# EAGLE design 5v ac to dc (EAGLE 9.6.2)
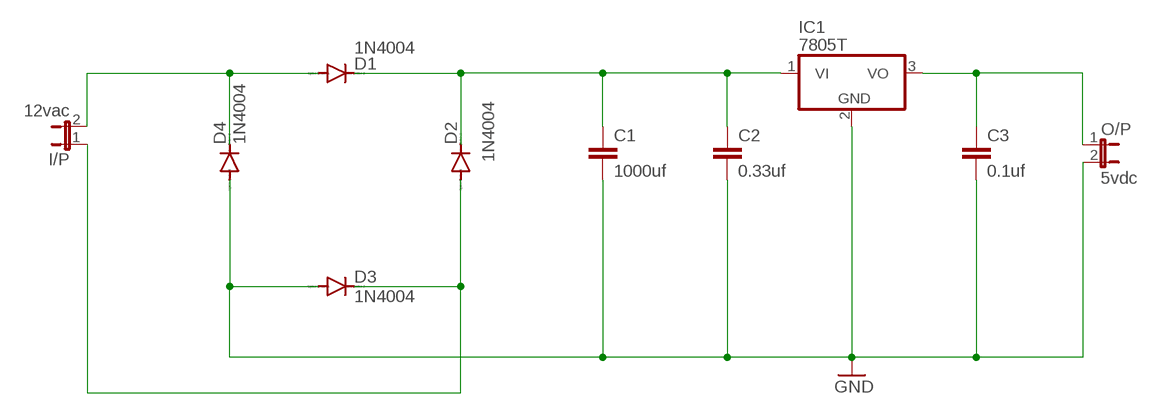
[diagram p0: schematic, sheet 1]

## Parts
C1  1000uf  C2,5-3  [C2.5-3]
C2  0.33uf  C2,5-3  [C2.5-3]
C3  0.1uf  C2,5-3  [C2.5-3]
D1  1N4004  [DO41-10]
D2  1N4004  [DO41-10]
D3  1N4004  [DO41-10]
D4  1N4004  [DO41-10]
I/P  12vac  JP1E  [JP1]
IC1  7805T  [TO220H]
O/P  5vdc  JP1E  [JP1]

## Nets
GND: C1.2 C2.2 C3.2 D3.A D4.A IC1.2(GND) O/P.2
N$2: D2.A D3.C I/P.1
N$3: D1.A D4.C I/P.2
N$4: C1.1 C2.1 D1.C D2.C IC1.1(VI)
N$11: C3.1 IC1.3(VO) O/P.1

## Library data of the parts
C1-C3 = capacitor-wima:C: CAPACITOR naming: grid - package width
D1-D4 = diode:1N4004: DIODE general purpose rectifier, 1 A
I/P O/P = jumper:JP1E: JUMPER
IC1 = linear:78*: Positive VOLTAGE REGULATOR Source: http://cache.national.com/ds/LM/LM78L05.pdf http://www.fairchildsemi.com/ds/LM/LM7805.pdf

## Board
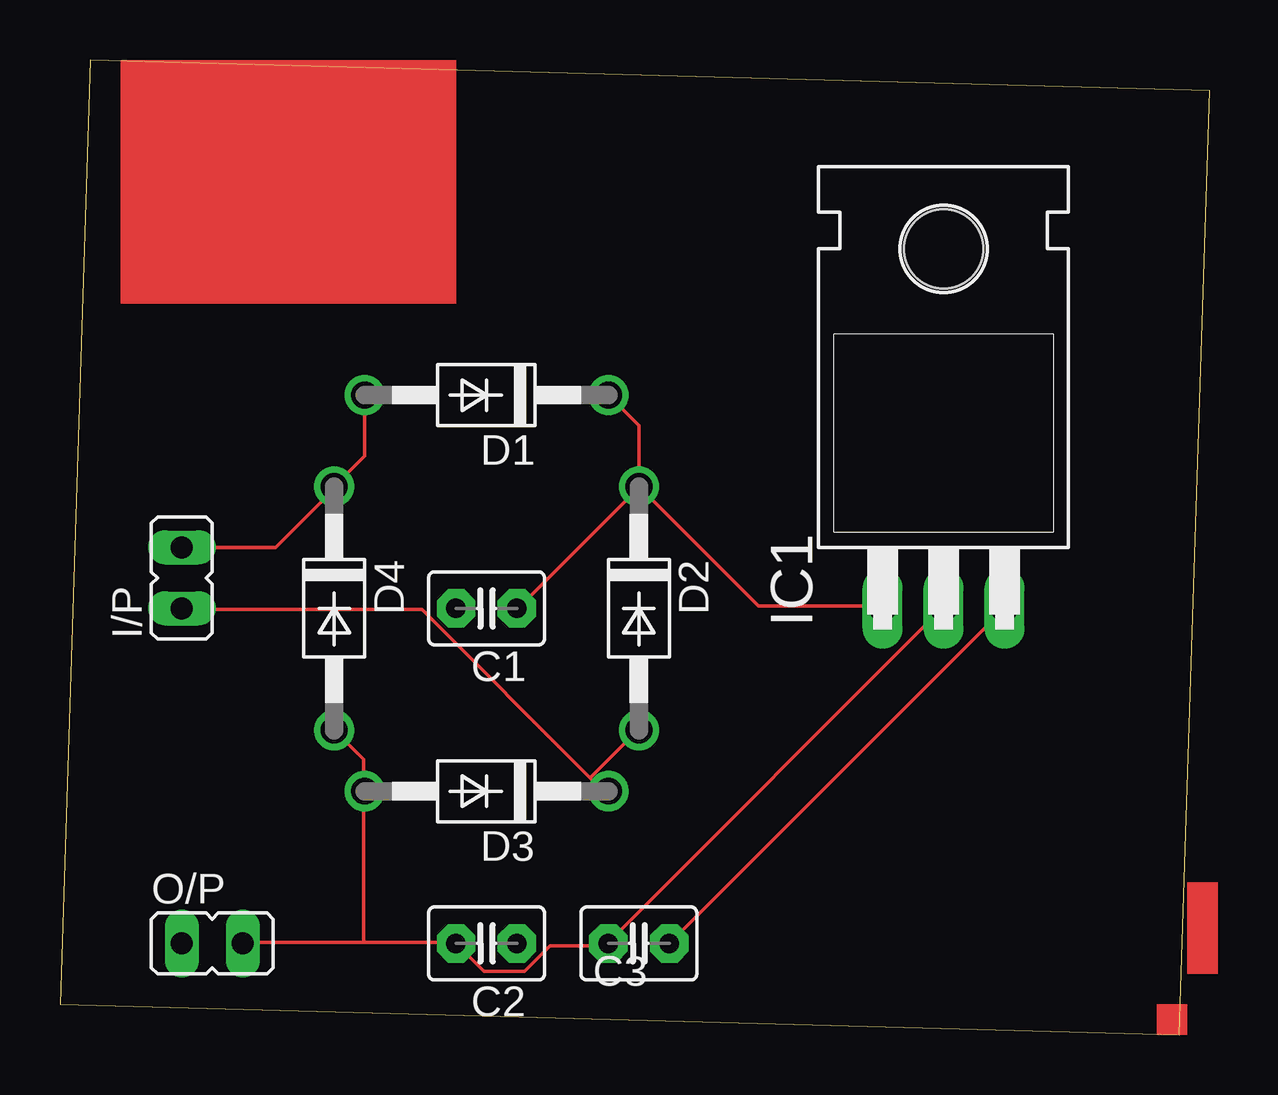
[diagram p1: board, top side]
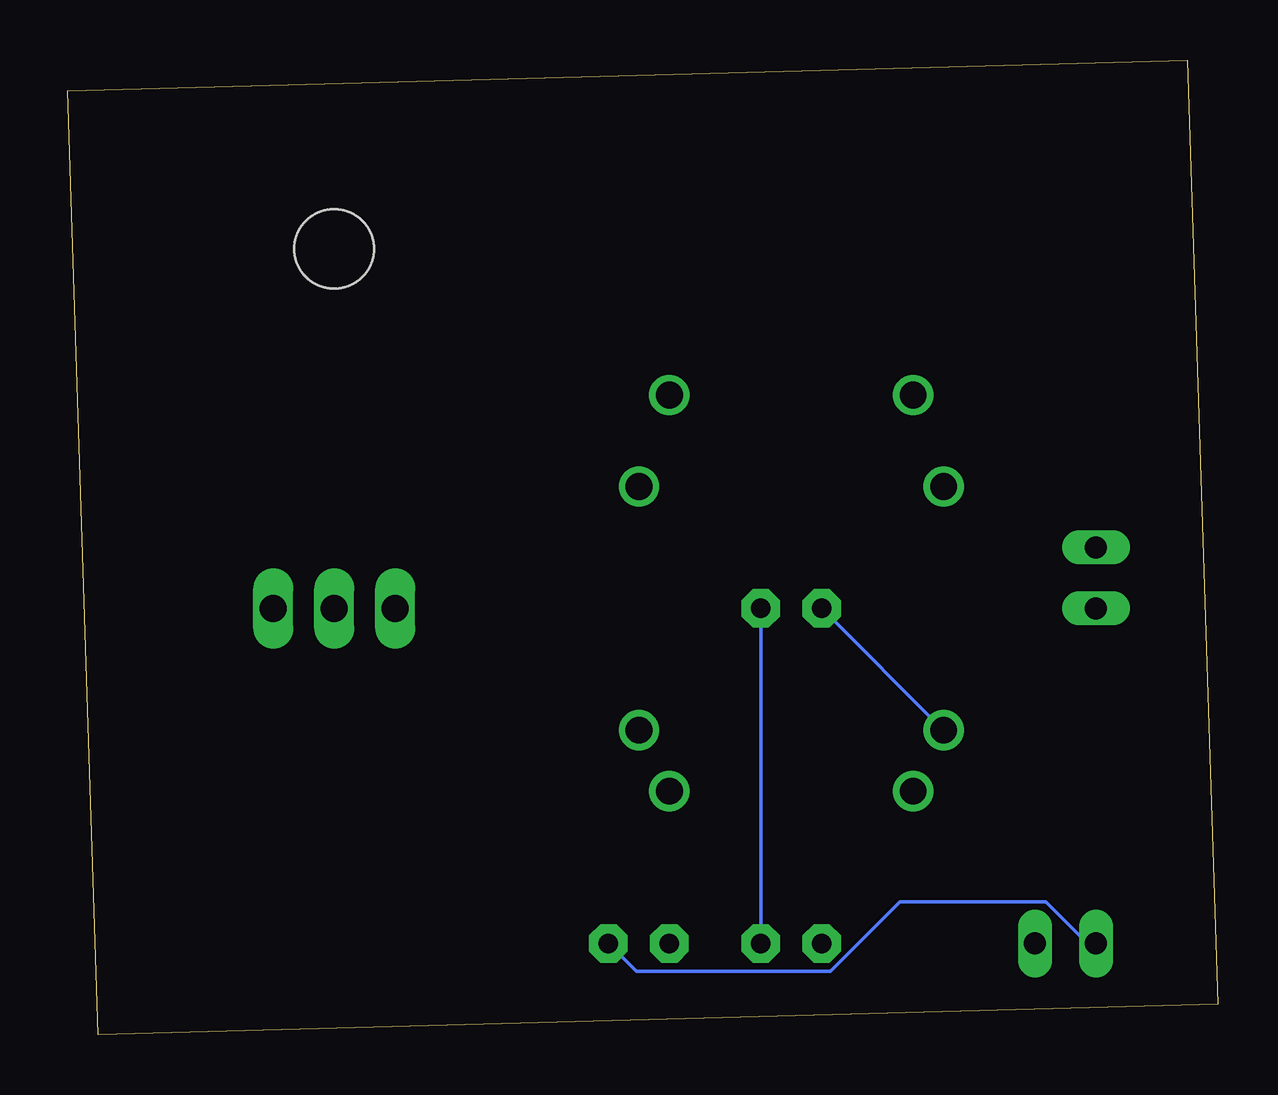
[diagram p2: board, bottom side, seen from below]

Size 47.93 x 40.63 mm. Coordinates in mm from the lower left corner, seen from the top.
Outline: 0,1.27 46.66,0 47.93,39.36 1.27,40.63 0,1.27
Copper layers (1*16): Top 0.035mm / dielectric 1.5mm / Bottom 0.035mm
Design rules "default": minimum track width 6mil, minimum drill 0.35mm, track to track 6mil, track to pad 6mil, pad to pad 6mil, via to via 6mil, smd to smd 6mil, copper to edge 40mil, drill to drill 6mil, minimum pad ring 10mil, minimum via ring 8mil, stop-mask expansion 4mil, vias tented up to drill 0mil, thermal gap 10mil

### Footprints (pad centres in the part's own frame; a part is rotated, then mirrored left to right if it is on the bottom)
C2.5-3 = drill 0.813 pad 1.6 octagon: 1 -1.27,0; 2 1.27,0
DO41-10 = drill 1.118: A 5.08,0; C -5.08,0
JP1 = drill 0.914 long: 1 0,-1.27; 2 0,1.27
TO220H = drill 1.118 long: 1 -2.54,-10.16; 2 0,-10.16; 3 2.54,-10.16 | hole 3.302: 0,4.826

### Placement (x,y rotation side)
C1  17.78,17.78 180 top
C2  17.78,3.81 180 top
C3  24.13,3.81 180 top
D1  17.78,26.67 180 top
D2  24.13,17.78 270 top
D3  17.78,10.16 180 top
D4  11.43,17.78 270 top
I/P  5.08,19.05 0 top
IC1  36.83,27.94 0 top
O/P  6.35,3.81 270 top

### Tracks (layer width: path | path; a pad name or v marks a point on that pad's centre or on a via)
GND
  Top 0.152: D4.A 12.65,11.48 12.65,10.26 D3.A 12.65,10.11 12.65,3.86 | 12.65,3.86 16.46,3.86 C2.2 17.68,2.64 19.36,2.64 20.42,3.71 22.86,3.71 C3.2 22.86,3.86 36.73,17.73 IC1.2 | 12.65,3.86 7.62,3.86 O/P.2
  Bottom 0.152: D4.A C1.2
  cutout Top: -5.08,49.53 62.23,49.53 62.23,-7.62 -12.7,-7.62 -12.7,49.53
  cutout Bottom: -13.97,53.34 69.85,53.34 69.85,-12.7 69.85,-13.97 -17.78,-13.97 -22.86,-13.97 -22.86,53.34
N$2
  Top 0.152: 22.1,10.72 22.55,10.26 22.86,10.26 D3.C | 22.1,10.72 15.09,17.73 5.18,17.73 I/P.1 | 22.1,10.72 24.08,12.7 D2.A
N$3
  Top 0.152: D1.A 12.7,24.13 D4.C 11.43,22.76 8.99,20.32 I/P.2
N$4
  Top 0.152: D1.C 24.13,25.4 D2.C | D2.C 29.11,17.88 34.29,17.88 IC1.1 | D2.C 24.08,22.76 19.05,17.73 C1.1
  Bottom 0.152: C1.1 C2.1
N$11
  Top 0.152: C3.1 IC1.3
  Bottom 0.152: C3.1 24.23,2.64 16.15,2.64 13.26,5.54 7.16,5.54 5.49,3.86 5.18,3.86 O/P.1
(copper drawn outside any net)
  shapes: Top area x4

### Text on the board
tValues: C-DAC HYD